# Altium project ESP_MusicToy.PrjPcb (part 2 of 2)

## Sheet [04] Power & Battery.SchDoc
size A3; Author: Caner ALP; Organization: ALP Electronics; Address1: Axel Oxenstiernas; Address2: Västerås; Address3: 72478; Address4: Sweden; DocumentNumber: 5; SheetNumber: 5; SheetTotal: 7
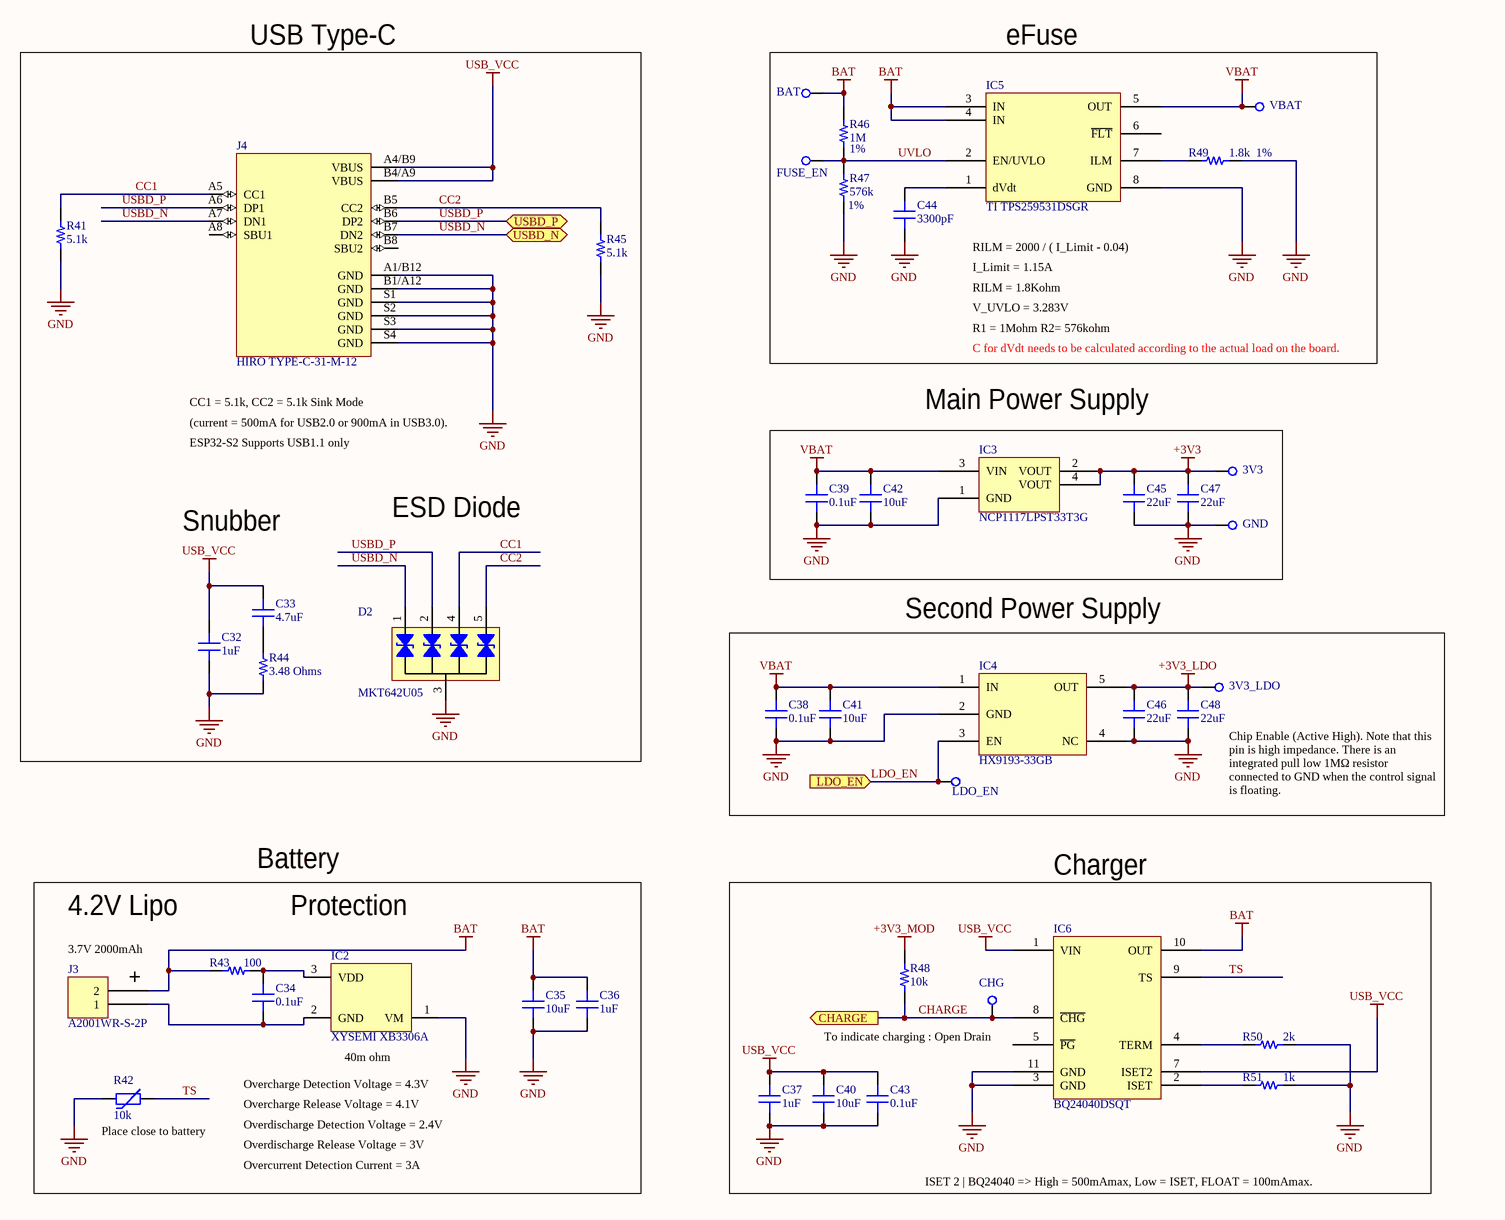
[diagram p4: [04] Power & Battery.SchDoc]

### Parts
3V3  RCT-0C  [TE TP 0805]  (value not drawn)
3V3_LDO  RCT-0C  [TE TP 0805]  (value not drawn)
BAT  RCT-0C  [0.5mm-TestPad]  (value not drawn)
C32  1uF  [CAP 0603/1608]
C33  4.7uF  [CAP 0603/1608]
C34  0.1uF  [CAP 0603/1608]
C35  10uF  [CAP 0603/1608]
C36  1uF  [CAP 0603/1608]
C37  1uF  [CAP 0603/1608]
C38  0.1uF  [CAP 0402/1005]
C39  0.1uF  [CAP 0402/1005]
C40  10uF  [CAP 0603/1608]
C41  10uF  [CAP 0603/1608]
C42  10uF  [CAP 0603/1608]
C43  0.1uF  [CAP 0402/1005]
C44  3300pF  [CAP 0402/1005]
C45  22uF  [CAP 0603/1608]
C46  22uF  [CAP 0603/1608]
C47  22uF  [CAP 0603/1608]
C48  22uF  [CAP 0603/1608]
CHG  RCT-0C  [0.5mm-TestPad]  (value not drawn)
D2  MKT642U05  [TI USON-10 DQA]
FUSE_EN  RCT-0C  [0.5mm-TestPad]  (value not drawn)
GND  RCT-0C  [TE TP 0805]  (value not drawn)
IC2  XYSEMI XB3306A  [DIODES SOT-23-3]
IC3  NCP1117LPST33T3G  [ON SEMI SOT-223 ST(318H)]
IC4  HX9193-33GB  [DBV005]
IC5  TI TPS259531DSGR  [TI WSON-8 DSG 2x2MM]
IC6  BQ24040DSQT  [TI PWSON-10 DSQ]
J3  A2001WR-S-2P  [JST S2B-PH-SM4-TB]
J4  HIRO TYPE-C-31-M-12  [HIRO TYPE-C-31-M-12]
LDO_EN  RCT-0C  [0.5mm-TestPad]  (value not drawn)
R41  5.1k  [RES 0402/1005]
R42  Resistance in Ohms @ 25C: 10k  [FER 0603/1608]
R43  100  [RES 0603/1608]
R44  3.48 Ohms  [RES 0805_2012]
R45  5.1k  [RES 0402/1005]
R46  1M  Tolerance: 1%  [RES 0402/1005]
R47  576k  Tolerance: 1%  [RES 0402/1005]
R48  10k  [RES 0402/1005]
R49  1.8k  Tolerance: 1%  [RES 0402/1005]
R50  2k  [RES 0402/1005]
R51  1k  [RES 0402/1005]
VBAT  RCT-0C  [0.5mm-TestPad]  (value not drawn)

### Blocks framed on the sheet
eFuse: BAT C44 FUSE_EN IC5 R46 R47 R49 VBAT
Main Power Supply: 3V3 C39 C42 C45 C47 GND IC3
Second Power Supply: 3V3_LDO C38 C41 C46 C48 IC4 LDO_EN
Charger: C37 C40 C43 CHG IC6 R48 R50 R51

### Ports
CHARGE (out), LDO_EN (in), USBD_N (bidir), USBD_P (bidir)

### Nets
+3V3: 3V3.1(TP) C45.2 C47.2 IC3.2(VOUT) IC3.4(VOUT)
+3V3_LDO: 3V3_LDO.1(TP) C46.2 C48.2 IC4.5(OUT)
+3V3_MOD: R48.2
BAT: BAT.1(TP) C35.2 C36.1 IC5.3(IN) IC5.4(IN) IC6.10(OUT) J3.2 R43.1 R46.2
GND: C32.2 C35.1 C36.2 C37.2 C38.1 C39.1 C40.1 C41.1 C42.1 C43.1 C44.1 C45.1 C46.1 C47.1 C48.1 D2.3(GND) GND.1(TP) IC2.1(VM) IC3.1(GND) IC4.2(GND) IC4.4(NC) IC5.8(GND) IC6.3(GND) IC6.11(GND) J4.A1/B12(GND) J4.B1/A12(GND) J4.S1(GND) J4.S2(GND) J4.S3(GND) J4.S4(GND) R41.1 R42.1 R44.1 R45.1 R47.1 R49.2 R50.1 R51.2
USB_VCC: C32.1 C33.2 C37.1 C40.2 C43.2 IC6.1(VIN) IC6.7(ISET2) J4.A4/B9(VBUS) J4.B4/A9(VBUS)
VBAT: C38.2 C39.2 C41.2 C42.2 IC3.3(VIN) IC4.1(IN) IC5.5(OUT) VBAT.1(TP)
CC1: D2.4(D3) J4.A5(CC1) R41.2
CC2: D2.5(D4) J4.B5(CC2) R45.2
CHARGE: CHG.1(TP) IC6.8(~{CHG}) R48.1 ; port CHARGE
LDO_EN: IC4.3(EN) LDO_EN.1(TP) ; port LDO_EN
TS: IC6.9(TS) R42.2
USBD_N: D2.1(D1) J4.A7(DN1) J4.B7(DN2) ; port USBD_N
USBD_P: D2.2(D2) J4.A6(DP1) J4.B6(DP2) ; port USBD_P
UVLO: FUSE_EN.1(TP) IC5.2(EN/UVLO) R46.1 R47.2
NetC33_1: C33.1 R44.2
NetC34_1: C34.1 IC2.3(VDD) R43.2
NetC34_2: C34.2 IC2.2(GND) J3.1
NetC44_2: C44.2 IC5.1(dVdt)
NetIC5_7: IC5.7(ILM) R49.1
NetIC6_2: IC6.2(ISET) R51.1
NetIC6_4: IC6.4(TERM) R50.2

Not connected (* = marked no-connect by the designer): IC5 6(~{FLT}); IC6 5(~{PG}); J4 A8(SBU1) B8(SBU2)

### Notes on the sheet
- USB Type-C
- RILM = 2000 / ( I_Limit - 0.04)
- V_UVLO = 3.283V
- I_Limit = 1.15A
- RILM = 1.8Kohm
- R1 = 1Mohm R2= 576kohm
- C for dVdt needs to be calculated according to the actual load on the board.
- (current = 500mA for USB2.0 or 900mA in USB3.0).
- CC1 = 5.1k, CC2 = 5.1k Sink Mode
- ESP32-S2 Supports USB1.1 only
- ESD Diode
- Snubber
- Chip Enable (Active High). Note that this pin is high impedance. There is an integrated pull low 1MΩ resistor connected to GND when the control signal is floating.
- 4.2V Lipo
- Battery
- Protection
- (near J3) 3.7V 2000mAh
- (near J3) +
- (near IC2) 40m ohm
- To indicate charging : Open Drain
- (near R42) Place close to battery
- Overcharge Detection Voltage = 4.3V
- Overdischarge Detection Voltage = 2.4V
- Overcharge Release Voltage = 4.1V
- Overdischarge Release Voltage = 3V
- Overcurrent Detection Current = 3A
- ISET 2 | BQ24040 => High = 500mAmax, Low = ISET, FLOAT = 100mAmax.
- Title
- Size:
- Project
- A3
- Revision:
- Date:
- Sheet
- of

### Library data of the parts
3V3 3V3_LDO BAT CHG FUSE_EN GND LDO_EN VBAT = RCT-0C: 0805 PROBE PAD; Manufacturer: TE Connectivity AMP Connectors; Part Number: RCT-0C; PartId: 15704; Supplier 1: Digi-Key; Supplier Part Number 1: A106144CT-ND; ComponentLink1Description: Datasheet; ComponentLink1URL: http://www.te.com/commerce/DocumentDelivery/DDEController?Action=srchrtrv&DocNm=1773266&DocType=DS&DocLang=English; ComponentLink2Description: Digi-Key Listing; ComponentLink2URL: http://www.digikey.com/product-detail/en/te-connectivity-amp-connectors/RCT-0C/A106144CT-ND/3477801; Price: 0,14; Type: PC Test Point; Mounting Type: Surface Mount
C32 C36 C37 = CGB3B1X7R1A105K055AC: CAP CER 1UF 10V X7R 0603; Manufacturer: TDK Corporation; TemperatureRange: -55C ~ 125C; Tolerance: 10%; Type: Low Profile; Value: 1uF; Part Number: CGB3B1X7R1A105K055AC; PartId: 4131; Supplier 1: Digi-Key; Supplier Part Number 1: 445-13228-1-ND; ComponentLink1Description: Datasheet; ComponentLink1URL: https://product.tdk.com/info/en/catalog/datasheets/mlcc_commercial_lowprofile_en.pdf; ComponentLink2Description: Digi-Key listing; ComponentLink2URL: http://digikey.com/product-detail/en/CGB3B1X7R1A105K055AC/445-13228-1-ND/3954894; TemperatureCoefficient: X7R; Voltage: 10V; Price: 0,27; Device Package: 0603 (1608 Metric)
C33 = C1608X5R1A475K080AC: CAP CER 4.7UF 10V X5R 0603; Manufacturer: TDK Corporation; TemperatureRange: -55C ~ 85C; Tolerance: 10%; Value: 4.7uF; Part Number: C1608X5R1A475K080AC; PartId: 13010; Supplier 1: Digi-Key; Supplier Part Number 1: 445-5170-2-ND; ComponentLink1Description: Datasheet; ComponentLink1URL: https://product.tdk.com/info/en/catalog/datasheets/mlcc_commercial_general_en.pdf; ComponentLink2Description: Digi-Key Listing; ComponentLink2URL: https://www.digikey.com/product-detail/en/tdk-corporation/C1608X5R1A475K080AC/445-5170-2-ND/2093438; TemperatureCoefficient: X5R; Voltage: 10V; Price: 0,0333; Device Package: 0603 (1608 Metric)
C34 = CC0603KPX7R7BB104: CAP CER 0.1UF 16V X7R 0603; Manufacturer: Yageo; TemperatureRange: -55C ~ 125C; Tolerance: 10%; Value: 0.1uF; Part Number: CC0603KPX7R7BB104; PartId: 5262; Supplier 1: Digi-Key; Supplier Part Number 1: 311-1335-2-ND; ComponentLink1Description: Datasheet; ComponentLink1URL: http://www.yageo.com/documents/recent/UPY-GPHC_X7R_6.3V-to-50V-v12.pdf; ComponentLink2Description: Digi-Key listing; ComponentLink2URL: http://digikey.com/product-detail/en/CC0603KPX7R7BB104/311-1335-2-ND/2103073; TemperatureCoefficient: X7R; Voltage: 16V; Price: 0,0043; Type: -; Device Package: 0603 (1608 Metric)
C35 C40-C42 = C1608X5R1A106M080AC: CAP CER 10UF 10V X5R 0603; Manufacturer: TDK Corporation; TemperatureRange: -55C ~ 85C; Tolerance: 20%; Value: 10uF; Part Number: C1608X5R1A106M080AC; PartId: 13099; Supplier 1: Digi-Key; Supplier Part Number 1: 445-6853-2-ND; ComponentLink1Description: Datasheet; ComponentLink1URL: https://product.tdk.com/info/en/catalog/datasheets/mlcc_commercial_general_en.pdf; ComponentLink2Description: Digi-Key Listing; ComponentLink2URL: https://www.digikey.com/product-detail/en/tdk-corporation/C1608X5R1A106M080AC/445-6853-2-ND/2619194; TemperatureCoefficient: X5R; Voltage: 10V; Price: 0,0935; Device Package: 0603 (1608 Metric)
C38 C39 C43 = C1005X7R1A104K050BB: CAP CER 0.1UF 10V X7R 0402; Manufacturer: TDK Corporation; TemperatureRange: -55C ~ 125C; Tolerance: 10%; Value: 0.1uF; Part Number: C1005X7R1A104K050BB; PartId: 3900; Supplier 1: Digi-Key; Supplier Part Number 1: 445-4958-2-ND; ComponentLink1Description: Datasheet; ComponentLink1URL: https://product.tdk.com/info/en/catalog/datasheets/mlcc_commercial_general_en.pdf; ComponentLink2Description: Digi-Key listing; ComponentLink2URL: http://digikey.com/product-detail/en/C1005X7R1A104K050BB/445-4958-2-ND/2093226; TemperatureCoefficient: X7R; Voltage: 10V; Price: 0,0066; Type: -; Device Package: 0402 (1005 Metric)
C44 = CGJ2B2X7R1E332K050BA: CAP CER 3300PF 25V X7R 0402; Manufacturer: TDK Corporation; TemperatureRange: -55C ~ 125C; Tolerance: 10%; Value: 3300pF; Part Number: CGJ2B2X7R1E332K050BA; PartId: 12699; Supplier 1: Digi-Key; Supplier Part Number 1: 445-8075-2-ND; ComponentLink1Description: Datasheet; ComponentLink1URL: https://product.tdk.com/info/en/catalog/datasheets/mlcc_highreliability_general_en.pdf; ComponentLink2Description: Digi-Key Listing; ComponentLink2URL: https://www.digikey.com/product-detail/en/tdk-corporation/CGJ2B2X7R1E332K050BA/445-8075-2-ND/2812488; TemperatureCoefficient: X7R; Voltage: 25V; Price: 0,0192; Device Package: 0402 (1005 Metric)
C45-C48 = C1608X5R1A226M080AC: CAP CER 22UF 10V X5R 0603; Manufacturer: TDK Corporation; TemperatureRange: -55C ~ 85C; Tolerance: 20%; Value: 22uF; Part Number: C1608X5R1A226M080AC; PartId: 12987; Supplier 1: Digi-Key; Supplier Part Number 1: 445-9077-2-ND; ComponentLink1Description: Datasheet; ComponentLink1URL: https://product.tdk.com/info/en/catalog/datasheets/mlcc_commercial_general_en.pdf; ComponentLink2Description: Digi-Key Listing; ComponentLink2URL: https://www.digikey.com/product-detail/en/tdk-corporation/C1608X5R1A226M080AC/445-9077-2-ND/3661560; TemperatureCoefficient: X5R; Voltage: 10V; Price: 0,105; Device Package: 0603 (1608 Metric)
D2 = TPD4E05U06DQAR: TVS DIODE  4-Channel 5.5VWM 14VC 10SON; Manufacturer: Texas Instruments; Type: Zener; Bidirectional Channels: 4; Part Number: TPD4E05U06DQAR; PartId: 14960; Supplier 1: Digi-Key; Device Package: USON-10
IC2 = XYSEMI XB3306A: IC LITHIUM BATT PROTECT SOT23-3; Function: Protection; Battery Chemistry: Li-Ion, Li-Pol; Part Number: XYSEMI XB3306A; PartId: 16446; Manufacturer: XYSEMI; Supplier 1: LCSC; Supplier Part Number 1: C154939; ComponentLink1Description: Datasheet; ComponentLink1URL: http://www.baitaishengshi.com/uploadfile/2017/1213/20171213368970.pdf; ComponentLink2Description: LCSC Listing; ComponentLink2URL: https://lcsc.com/product-detail/Battery-Protection-ICs_XB3306A_C154939.html; Device Package: SOT-23-3
IC3 = NCP1117LPST33T3G: IC REG LDO 3.3V 1A SOT223; Manufacturer: ON Semiconductor; Topology: Positive Fixed; Voltage Dropout: 1.3V @ 1A; Voltage - Input: Up to 18V; Current - Limit (Min): 1.1A; Part Number: NCP1117LPST33T3G; PartId: 7931; Supplier 1: Digi-Key; Supplier Part Number 1: NCP1117LPST33T3GOSTR-ND; ComponentLink1Description: Datasheet; ComponentLink1URL: http://www.onsemi.com/pub_link/Collateral/NCP1117LP-D.PDF; ComponentLink2Description: Digi-Key Listing; ComponentLink2URL: http://www.digikey.ca/product-detail/en/NCP1117LPST33T3G/NCP1117LPST33T3GOSTR-ND/2194024; Price: 0,1843; Device Package: TO-261-4, TO-261AA; Voltage - Output: 3.3V; Operating Temperature: 0C ~ 125C
IC4 = TPS736xx: LDO
IC6 = BQ24040DSQT: IC LI-ION CHRG 800MA 6.6V 10SON; Manufacturer: Texas Instruments; Function: Charge Management; Battery Chemistry: Li-Ion, Li-Pol; Voltage Supply: 3.5 V ~ 28 V; Part Number: BQ24040DSQT; PartId: 9307; Supplier 1: Digi-Key; Supplier Part Number 1: 296-25136-2-ND; ComponentLink1Description: Datasheet; ComponentLink1URL: http://www.ti.com/lit/ds/symlink/bq24040.pdf; ComponentLink2Description: Digi-Key Listing; ComponentLink2URL: http://www.digikey.com/product-detail/en/BQ24040DSQT/296-25136-2-ND/2165906; Price: 0,9352; Device Package: 10-WFDFN Exposed Pad; Series: -; Operating Temperature: -40C ~ 85C
J3 = S2B-PH-SM4-TB(LF)(SN): CONN HEADER SMD R/A 2POS 2MM; Manufacturer: JST Sales America Inc.; Contact Length - Mating: 0.130" (3.30mm); Current Rating (Amps): 2A; Material Flammability Rating: UL94 V-0; Number of Positions: 2; Number of Positions Loaded: All; Pitch - Mating: 0.079" (2.00mm); Shrouding: Shrouded - 4 Wall; Style: Board to Cable/Wire; Voltage Rating: 100V; Part Number: S2B-PH-SM4-TB(LF)(SN); ComponentLink1Description: Datasheet; ComponentLink1URL: http://www.jst-mfg.com/product/pdf/eng/ePH.pdf; ComponentLink2Description: DigiKey Link; ComponentLink2URL: http://digikey.com/product-detail/en/jst-sales-america-inc/S2B-PH-SM4-TB-LF-SN/455-1749-1-ND/926846; Connector Type: Header; Contact Finish - Mating: Tin; Contact Finish - Post: Tin; Contact Material: Copper Alloy; Contact Shape: Square; Contact Type: Male Pin; Fastening Type: Detent Lock; Features: Solder Retention; Insulation Color: Natural; Insulation Height: 0.217" (5.51mm); Insulation Material: Polyamide (PA6T), Nylon 6T; LastUpdated: 2020-01-15 03:45:11; Lifecycle Status: Active; Minimum Order: 1; Mounting Type: Surface Mount, Right Angle; Number of Rows: 1; Operating Temperature: -25°C ~ 85°C; Packaging: TapeAndReel; PartId: 115; Part Status: Active; Price: 0.27; Series: PH; Supplier 1: DigiKey; Supplier Part Number 1: 455-1749-1-ND; Termination: Solder
J4 = HIRO TYPE-C-31-M-12: CONN USB 2.0 TYPE-C R/A SMT; Number Of Positions: 12; Part Number: HIRO TYPE-C-31-M-12; PartId: 9703; Manufacturer: Hiro; Supplier 1: LCSC; Supplier Part Number 1: C165948; ComponentLink1Description: Datasheet; ComponentLink1URL: https://datasheet.lcsc.com/szlcsc/1811131825_Korean-Hroparts-Elec-TYPE-C-31-M-12_C165948.pdf; ComponentLink2Description: LCSC Listing; ComponentLink2URL: https://lcsc.com/product-detail/USB-Type-C_Korean-Hroparts-Elec-TYPE-C-31-M-12_C165948.html; Type: USB - C; Series: USB 3.0
R41 R45 = ERJ-2RKF5101X: RES SMD 5.1K OHM 1% 1/10W 0402; Manufacturer: Panasonic Electronic Components; TemperatureRange: -55C ~ 155C; TemperatureCoefficient: 100ppm/C; PowerRating: 0.1W, 1/10W; Value: 5.1k; Part Number: ERJ-2RKF5101X; PartId: 274; Supplier 1: Digi-Key; Supplier Part Number 1: P5.10KLTR-ND; ComponentLink1Description: Datasheet; ComponentLink1URL: http://industrial.panasonic.com/www-cgi/jvcr13pz.cgi?E+PZ+3+AOA0002+ERJ2RKF5101X+7+WW; ComponentLink2Description: Digikey listing; ComponentLink2URL: http://digikey.com/product-detail/en/ERJ-2RKF5101X/P5.10KLTR-ND/1746242; Tolerance: 1%; Price: 0,0043; Type: Thick Film; Device Package: 0402 (1005 Metric)
R42 = B57330V2103J260: NTC 0603 10K OHM 5%; Manufacturer: EPCOS (TDK); TemperatureRange: -55C ~ 125C; B Value Tolerance: 3%; B25/50: 3380K; B25/85: 3435K; B25/100: 3455K; Power - Max: 180mW; Value: 10k; Part Number: B57330V2103J260; PartId: 16688; Supplier 1: Digi-Key; Supplier Part Number 1: 495-5817-2-ND; ComponentLink1Description: Datasheet; ComponentLink1URL: https://product.tdk.com/search-template/en/documents/data_sheet/50/db/ntc_13/NTC_SMD_Standard_series_0603.pdf; ComponentLink2Description: Digi-Key Listing; ComponentLink2URL: https://www.digikey.com/product-detail/en/epcos-tdk/B57330V2103J260/495-5817-2-ND/4360622; Price: 0,1225; Resistance Tolerance: 5%; Device Package: 0603 (1608 Metric)
R43 = ERJ-3GEYJ101V: RES SMD 100 OHM 5% 1/10W 0603; Manufacturer: Panasonic Electronic Components; TemperatureRange: -55C ~ 155C; TemperatureCoefficient: 200ppm/C; PowerRating: 0.1W, 1/10W; Value: 100; Part Number: ERJ-3GEYJ101V; PartId: 11179; Supplier 1: Digi-Key; Supplier Part Number 1: P100GTR-ND; ComponentLink1Description: Datasheet; ComponentLink1URL: http://industrial.panasonic.com/www-cgi/jvcr13pz.cgi?E+PZ+3+AOA0001+ERJ3GEYJ101V+7+WW; ComponentLink2Description: Digi-Key Listing; ComponentLink2URL: https://www.digikey.com/product-detail/en/panasonic-electronic-components/ERJ-3GEYJ101V/P100GTR-ND/135659; Tolerance: 5%; Price: 0,002; Device Package: 0603 (1608 Metric)
R44 = RC0805FR-073R48L: RES SMD 3.48 OHM 1% 1/8W 0805; Manufacturer: Yageo; Power (Watts): 0.125W, 1/8W; Temperature Coefficient: ±200ppm/°C; Part Number: RC0805FR-073R48L; Value: 3.48 Ohms; ComponentLink1Description: Datasheet; ComponentLink1URL: https://www.yageo.com/upload/media/product/productsearch/datasheet/rchip/PYu-RC_Group_51_RoHS_L_10.pdf; ComponentLink2Description: DigiKey Link; ComponentLink2URL: http://digikey.com/product-detail/en/yageo/RC0805FR-073R48L/311-3.48CRCT-ND/730768; Composition: Thick Film; Device Package: 0805 (2012 Metric); Features: Moisture Resistant; Height - Seated (Max): 0.024" (0.60mm); LastUpdated: 21/01/2020 01:49:21; Lifecycle Status: Active; Minimum Order: 1; Number of Terminations: 2; Operating Temperature: -55°C ~ 155°C; Package / Case: 0805 (2012 Metric); Packaging: TapeAndReel; PartId: 29394; Part Status: Active; Price: 0.01; Resistance: 3.48 Ohms; Series: RC; Size / Dimension: 0.079" L x 0.049" W (2.00mm x 1.25mm); Supplier 1: DigiKey; Supplier Part Number 1: 311-3.48CRCT-ND; Supplier Device Package: 0805; Tolerance: ±1%
R46 = ERJ-2RKF1004X: RES SMD 1M OHM 1% 1/10W 0402; Manufacturer: Panasonic Electronic Components; TemperatureRange: -55C ~ 155C; TemperatureCoefficient: 100ppm/C; PowerRating: 0.1W, 1/10W; Value: 1M; Part Number: ERJ-2RKF1004X; PartId: 7; Supplier 1: Digi-Key; Supplier Part Number 1: P1.00MLTR-ND; ComponentLink1Description: Datasheet; ComponentLink1URL: http://industrial.panasonic.com/www-cgi/jvcr13pz.cgi?E+PZ+3+AOA0002+ERJ2RKF1004X+7+WW; ComponentLink2Description: Digikey listing; ComponentLink2URL: http://digikey.com/product-detail/en/ERJ-2RKF1004X/P1.00MLTR-ND/79728; Price: 0,0043; Type: Thick Film; Device Package: 0402 (1005 Metric)
R47 = ERJ-2RKF5763X: RES SMD 576K OHM 1% 1/10W 0402; Manufacturer: Panasonic Electronic Components; TemperatureRange: -55C ~ 155C; TemperatureCoefficient: 100ppm/C; PowerRating: 0.1W, 1/10W; Value: 576k; Part Number: ERJ-2RKF5763X; PartId: 437; Supplier 1: Digi-Key; Supplier Part Number 1: P576KLTR-ND; ComponentLink1Description: Datasheet; ComponentLink1URL: http://industrial.panasonic.com/www-cgi/jvcr13pz.cgi?E+PZ+3+AOA0002+ERJ2RKF5763X+7+WW; ComponentLink2Description: Digikey listing; ComponentLink2URL: http://digikey.com/product-detail/en/ERJ-2RKF5763X/P576KLTR-ND/192415; Price: 0,0043; Type: Thick Film; Device Package: 0402 (1005 Metric)
R48 = RC0402JR-0710KL: RES SMD 10K OHM 5% 1/16W 0402; Manufacturer: Yageo; TemperatureRange: -55C ~ 155C; TemperatureCoefficient: 100ppm/C; PowerRating: 0.063W, 1/16W; Value: 10k; Part Number: RC0402JR-0710KL; PartId: 14464; Supplier 1: Digi-Key; Supplier Part Number 1: 311-10KJRTR-ND; ComponentLink1Description: Datasheet; ComponentLink1URL: http://www.yageo.com/documents/recent/PYu-RC_Group_51_RoHS_L_04.pdf; ComponentLink2Description: Digi-Key Listing; ComponentLink2URL: https://www.digikey.com/product-detail/en/yageo/RC0402JR-0710KL/311-10KJRTR-ND/726418; Tolerance: 5%; Price: 0,0017; Device Package: 0402 (1005 Metric)
R49 = ERJ-2RKF1801X: RES SMD 1.8K OHM 1% 1/10W 0402; Manufacturer: Panasonic Electronic Components; TemperatureRange: -55C ~ 155C; TemperatureCoefficient: 100ppm/C; PowerRating: 0.1W, 1/10W; Value: 1.8k; Part Number: ERJ-2RKF1801X; PartId: 153; Supplier 1: Digi-Key; Supplier Part Number 1: P1.80KLTR-ND; ComponentLink1Description: Datasheet; ComponentLink1URL: http://industrial.panasonic.com/www-cgi/jvcr13pz.cgi?E+PZ+3+AOA0002+ERJ2RKF1801X+7+WW; ComponentLink2Description: Digikey listing; ComponentLink2URL: http://digikey.com/product-detail/en/ERJ-2RKF1801X/P1.80KLTR-ND/1746140; Price: 0,0043; Type: Thick Film; Device Package: 0402 (1005 Metric)
R50 = ERJ-2GEJ202X: RES SMD 2K OHM 5% 1/10W 0402; Manufacturer: Panasonic Electronic Components; TemperatureRange: -55C ~ 155C; TemperatureCoefficient: 200ppm/C; PowerRating: 0.1W, 1/10W; Value: 2k; Part Number: ERJ-2GEJ202X; PartId: 11049; Supplier 1: Digi-Key; Supplier Part Number 1: P2.0KJTR-ND; ComponentLink1Description: Datasheet; ComponentLink1URL: http://industrial.panasonic.com/www-cgi/jvcr13pz.cgi?E+PZ+3+AOA0001+ERJ2GEJ202X+7+WW; ComponentLink2Description: Digi-Key Listing; ComponentLink2URL: https://www.digikey.com/product-detail/en/panasonic-electronic-components/ERJ-2GEJ202X/P2.0KJTR-ND/146958; Tolerance: 5%; Price: 0,0019; Device Package: 0402 (1005 Metric)
R51 = ERJ-2RKF1001X: RES SMD 1K OHM 1% 1/10W 0402; Manufacturer: Panasonic Electronic Components; TemperatureRange: -55C ~ 155C; TemperatureCoefficient: 100ppm/C; PowerRating: 0.1W, 1/10W; Value: 1k; Part Number: ERJ-2RKF1001X; PartId: 4; Supplier 1: Digi-Key; Supplier Part Number 1: P1.00KLTR-ND; ComponentLink1Description: Datasheet; ComponentLink1URL: http://industrial.panasonic.com/www-cgi/jvcr13pz.cgi?E+PZ+3+AOA0002+ERJ2RKF1001X+7+WW; ComponentLink2Description: Digikey listing; ComponentLink2URL: http://digikey.com/product-detail/en/ERJ-2RKF1001X/P1.00KLTR-ND/79729; Tolerance: 1%; Price: 0,0043; Type: Thick Film; Device Package: 0402 (1005 Metric)

## Sheet [05] NFC.SchDoc: NFC
size A3; Author: Caner ALP; Organization: ALP Electronics; Address1: Axel Oxenstiernas; Address2: Västerås; Address3: 72478; Address4: Sweden; DocumentNumber: 6; SheetNumber: 6; SheetTotal: 7
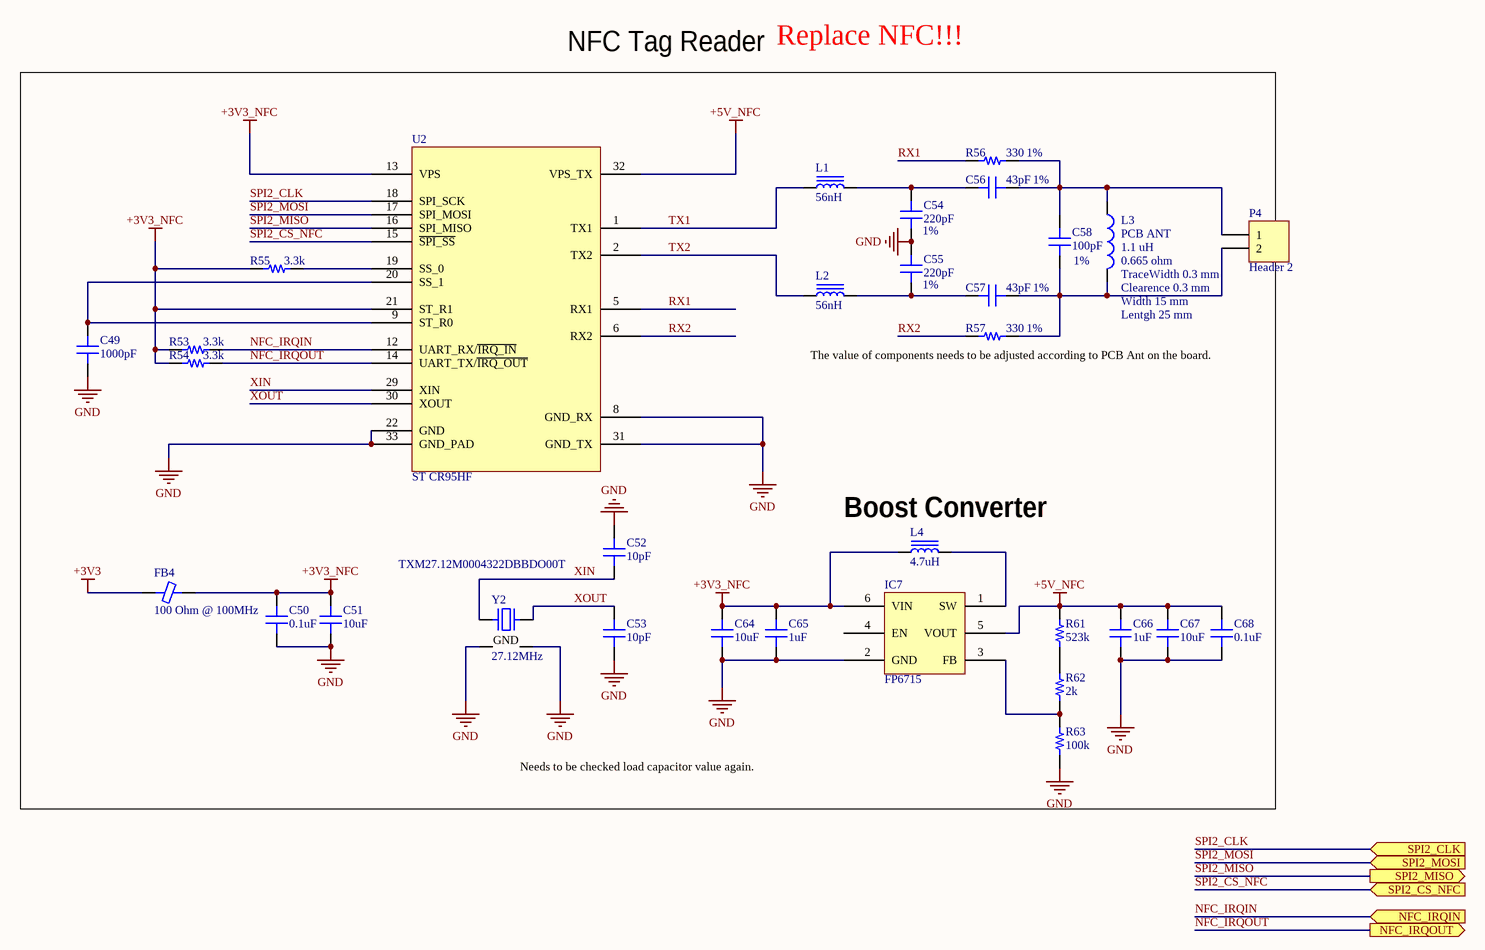
[diagram p5: [05] NFC.SchDoc]

### Parts
C49  1000pF  [CAP 0402/1005]
C50  0.1uF  [CAP 0402/1005]
C51  10uF  [CAP 0603/1608]
C52  10pF  [CAP 0402/1005]
C53  10pF  [CAP 0402/1005]
C54  220pF  Tolerance: 1%  [CAP 0402/1005]
C55  220pF  Tolerance: 1%  [CAP 0402/1005]
C56  43pF  Tolerance: 1%  [CAP 0402/1005]
C57  43pF  Tolerance: 1%  [CAP 0402/1005]
C58  100pF  Tolerance: 1%  [CAP 0402/1005]
C64  10uF  [CAP 0603/1608]
C65  1uF  [CAP 0603/1608]
C66  1uF  [CAP 0603/1608]
C67  10uF  [CAP 0603/1608]
C68  0.1uF  [CAP 0402/1005]
FB4  100 Ohm @ 100MHz  [FER 0603/1608]
IC7  FP6715  [ATMEL SOT-23-6 6ST1]
L1  56nH  [IND 0402/1005 RF WW]
L2  56nH  [IND 0402/1005 RF WW]
L3  PCB ANT  L_ANT: 1.1 uH  R_ANT: 0.665 ohm  TraceWidth: TraceWidth 0.3 mm  Clearence: Clearence 0.3 mm  Width: Width 15 mm  Length: Lentgh 25 mm  [0402-A]
L4  4.7uH  [TDK SPM3012]
P4  Header 2  [HDR1X2]
R53  3.3k  [RES 0402/1005]
R54  3.3k  [RES 0402/1005]
R55  3.3k  [RES 0402/1005]
R56  330  Tolerance: 1%  [RES 0402/1005]
R57  330  Tolerance: 1%  [RES 0402/1005]
R61  523k  [RES 0402/1005]
R62  2k  [RES 0402/1005]
R63  100k  [RES 0402/1005]
U2  ST CR95HF  [ST VFQFPN-32]
Y2  27.12MHz  Part Number: TXM27.12M0004322DBBDO00T  [NDK NX3225SA]

### Ports
NFC_IRQIN (in), NFC_IRQOUT (out), SPI2_CLK (in), SPI2_CS_NFC (in), SPI2_MISO (out), SPI2_MOSI (in)

### Nets
+3V3: FB4.1
+3V3_NFC: C50.2 C51.2 C64.2 C65.2 FB4.2 IC7.6(VIN) L4.1 R53.1 R54.1 R55.1 U2.13(VPS) U2.21(ST_R1)
+5V_NFC: C66.2 C67.2 C68.2 IC7.5(VOUT) R61.2 U2.32(VPS_TX)
GND: C49.1 C50.1 C51.1 C52.2 C53.1 C54.1 C55.2 C64.1 C65.1 C66.1 C67.1 C68.1 IC7.2(GND) R63.1 U2.8(GND_RX) U2.22(GND) U2.31(GND_TX) U2.33(GND_PAD) Y2.2(GND) Y2.4(GND)
NFC_IRQIN: R53.2 U2.12(UART_RX/~{IRQ_IN}) ; port NFC_IRQIN
NFC_IRQOUT: R54.2 U2.14(UART_TX/~{IRQ_OUT}) ; port NFC_IRQOUT
RX1: R56.1 U2.5(RX1)
RX2: R57.1 U2.6(RX2)
SPI2_CLK: U2.18(SPI_SCK) ; port SPI2_CLK
SPI2_CS_NFC: U2.15(~{SPI_SS}) ; port SPI2_CS_NFC
SPI2_MISO: U2.16(SPI_MISO) ; port SPI2_MISO
SPI2_MOSI: U2.17(SPI_MOSI) ; port SPI2_MOSI
TX1: L1.1 U2.1(TX1)
TX2: L2.1 U2.2(TX2)
XIN: C52.1 U2.29(XIN) Y2.1
XOUT: C53.2 U2.30(XOUT) Y2.3
NetC49_2: C49.2 U2.9(ST_R0) U2.20(SS_1)
NetC54_2: C54.2 C56.1 L1.2
NetC55_1: C55.1 C57.1 L2.2
NetC56_2: C56.2 C58.2 L3.1 P4.1 R56.2
NetC57_2: C57.2 C58.1 L3.2 P4.2 R57.2
NetIC7_1: IC7.1(SW) L4.2
NetIC7_3: IC7.3(FB) R62.1 R63.2
NetR55_2: R55.2 U2.19(SS_0)
NetR61_1: R61.1 R62.2

Not connected (* = marked no-connect by the designer): IC7 4(EN); U2 3(NC) 4(NC) 7(NC) 10(NC) 11(NC) 23(NC) 24(NC) 25(NC) 26(NC) 27(NC) 28(NC)

### Notes on the sheet
- NFC Tag Reader
- Replace NFC!!!
- (near R57) The value of components needs to be adjusted according to PCB Ant on the board.
- (near L4) Boost Converter
- Needs to be checked load capacitor value again.
- Title
- Size:
- Project
- A3
- Revision:
- Date:
- Sheet
- of

### Library data of the parts
C49 = C0402C102K9RACTU: CAP CER 1000PF 6.3V X7R 0402; Manufacturer: Kemet; TemperatureRange: -55C ~ 125C; Tolerance: 10%; Value: 1000pF; Part Number: C0402C102K9RACTU; PartId: 12782; Supplier 1: Digi-Key; Supplier Part Number 1: 399-8941-2-ND; ComponentLink1Description: Datasheet; ComponentLink1URL: http://www.kemet.com/docfinder?Partnumber=C0402C102K9RACTU; ComponentLink2Description: Digi-Key Listing; ComponentLink2URL: https://www.digikey.com/product-detail/en/kemet/C0402C102K9RACTU/399-8941-2-ND/2196206; TemperatureCoefficient: X7R; Voltage: 6.3V; Price: 0,0029; Device Package: 0402 (1005 Metric)
C50 C68 = C1005X7R1A104K050BB: as C38 on sheet [04] Power & Battery; Value: 0.1uF; Part Number: C1005X7R1A104K050BB; PartId: 3900; Supplier 1: Digi-Key; Supplier Part Number 1: 445-4958-2-ND; ComponentLink1Description: Datasheet; ComponentLink1URL: https://product.tdk.com/info/en/catalog/datasheets/mlcc_commercial_general_en.pdf; ComponentLink2Description: Digi-Key listing; ComponentLink2URL: http://digikey.com/product-detail/en/C1005X7R1A104K050BB/445-4958-2-ND/2093226; TemperatureCoefficient: X7R; Voltage: 10V; Price: 0,0066; Type: -; Device Package: 0402 (1005 Metric)
C51 C67 = C1608X5R1A106M080AC: as C35 on sheet [04] Power & Battery; Value: 10uF; Part Number: C1608X5R1A106M080AC; PartId: 13099; Supplier 1: Digi-Key; Supplier Part Number 1: 445-6853-2-ND; ComponentLink1Description: Datasheet; ComponentLink1URL: https://product.tdk.com/info/en/catalog/datasheets/mlcc_commercial_general_en.pdf; ComponentLink2Description: Digi-Key Listing; ComponentLink2URL: https://www.digikey.com/product-detail/en/tdk-corporation/C1608X5R1A106M080AC/445-6853-2-ND/2619194; TemperatureCoefficient: X5R; Voltage: 10V; Price: 0,0935; Device Package: 0603 (1608 Metric)
C52 C53 = C0402C100C8GACTU: CAP CER 10PF 10V NP0 0402; Manufacturer: Kemet; TemperatureRange: -55C ~ 125C; TemperatureCoefficient: C0G, NP0; Tolerance: 0.25pF; Value: 10pF; Part Number: C0402C100C8GACTU; PartId: 12811; Supplier 1: Digi-Key; Supplier Part Number 1: 399-8939-2-ND; ComponentLink1Description: Datasheet; ComponentLink1URL: http://www.kemet.com/docfinder?Partnumber=C0402C100C8GACTU; ComponentLink2Description: Digi-Key Listing; ComponentLink2URL: https://www.digikey.com/product-detail/en/kemet/C0402C100C8GACTU/399-8939-2-ND/2196146; Voltage: 10V; Price: 0,0523; Device Package: 0402 (1005 Metric)
C54 C55 = C1005C0G1H221F050BA: CAP CER 220PF 50V C0G 0402; Manufacturer: TDK Corporation; TemperatureRange: -55C ~ 125C; TemperatureCoefficient: C0G, NP0; Value: 220pF; Part Number: C1005C0G1H221F050BA; PartId: 3869; Supplier 1: Digi-Key; Supplier Part Number 1: 445-7015-2-ND; ComponentLink1Description: Datasheet; ComponentLink1URL: https://product.tdk.com/info/en/catalog/datasheets/mlcc_commercial_general_en.pdf; ComponentLink2Description: Digi-Key listing; ComponentLink2URL: http://digikey.com/product-detail/en/C1005C0G1H221F050BA/445-7015-2-ND/2674817; Voltage: 50V; Price: 0,1606; Type: -; Device Package: 0402 (1005 Metric)
C56 C57 = GRM1555C1H430GA01D: CAP CER 43PF 50V NP0 0402; Manufacturer: Murata Electronics North America; TemperatureRange: -55C ~ 125C; TemperatureCoefficient: C0G, NP0; Value: 43pF; Part Number: GRM1555C1H430GA01D; PartId: 5184; Supplier 1: Digi-Key; Supplier Part Number 1: 490-9664-2-ND; ComponentLink1Description: Datasheet; ComponentLink1URL: http://www.murata.com/~/media/webrenewal/support/library/catalog/products/capacitor/mlcc/c02e.ashx; ComponentLink2Description: Digi-Key listing; ComponentLink2URL: http://digikey.com/product-detail/en/GRM1555C1H430GA01D/490-9664-2-ND/3693990; Voltage: 50V; Price: 0,0202; Type: -; Device Package: 0402 (1005 Metric)
C58 = C1005C0G1H101F050BA: CAP CER 100PF 50V C0G 0402; Manufacturer: TDK Corporation; TemperatureRange: -55C ~ 125C; TemperatureCoefficient: C0G, NP0; Value: 100pF; Part Number: C1005C0G1H101F050BA; PartId: 3866; Supplier 1: Digi-Key; Supplier Part Number 1: 445-5362-2-ND; ComponentLink1Description: Datasheet; ComponentLink1URL: https://product.tdk.com/info/en/catalog/datasheets/mlcc_commercial_general_en.pdf; ComponentLink2Description: Digi-Key listing; ComponentLink2URL: http://digikey.com/product-detail/en/C1005C0G1H101F050BA/445-5362-2-ND/2269856; Voltage: 50V; Price: 0,1262; Type: -; Device Package: 0402 (1005 Metric)
C64 = C1608X5R1A106K080AC: CAP CER 10UF 10V X5R 0603; Manufacturer: TDK Corporation; TemperatureRange: -55C ~ 85C; Tolerance: 10%; Value: 10uF; Part Number: C1608X5R1A106K080AC; PartId: 13435; Supplier 1: Digi-Key; Supplier Part Number 1: 445-7486-2-ND; ComponentLink1Description: Datasheet; ComponentLink1URL: https://product.tdk.com/info/en/catalog/datasheets/mlcc_commercial_general_en.pdf; ComponentLink2Description: Digi-Key Listing; ComponentLink2URL: https://www.digikey.com/product-detail/en/tdk-corporation/C1608X5R1A106K080AC/445-7486-2-ND/2732921; TemperatureCoefficient: X5R; Voltage: 10V; Price: 0,102; Device Package: 0603 (1608 Metric)
C65 C66 = C0603C105K3RACTU: CAP CER 1UF 25V X7R 0603; Manufacturer: Kemet; TemperatureRange: -55C ~ 125C; Tolerance: 10%; Value: 1uF; Part Number: C0603C105K3RACTU; PartId: 13359; Supplier 1: Digi-Key; Supplier Part Number 1: 399-7376-2-ND; ComponentLink1Description: Datasheet; ComponentLink1URL: http://www.kemet.com/docfinder?Partnumber=C0603C105K3RACTU; ComponentLink2Description: Digi-Key Listing; ComponentLink2URL: https://www.digikey.com/product-detail/en/kemet/C0603C105K3RACTU/399-7376-2-ND/3317582; TemperatureCoefficient: X7R; Voltage: 25V; Price: 0,044; Device Package: 0603 (1608 Metric)
FB4 = BKP1608HS101-T: FERRITE CHIP 100 OHM 0603; Manufacturer: Taiyo Yuden; Type: Differential Mode - Single; DC Resistance: 50 mOhm Max; Current Rating: 1.7A; Part Number: BKP1608HS101-T; PartId: 6594; Value: 100 Ohm @ 100MHz; Supplier 1: Digi-Key; Supplier Part Number 1: 587-1922-2-ND; ComponentLink1Description: Datasheet; ComponentLink1URL: http://ds.yuden.co.jp/TYCOMPAS/ut/detail.do?productNo=BKP1608HS101-T&fileName=BKP1608HS101-T_SS&mode=specSheetDownload; ComponentLink2Description: Digi-Key listing; ComponentLink2URL: http://digikey.com/product-detail/en/BKP1608HS101-T/587-1922-2-ND/957775; Price: 0,0247; Device Package: 0603 (1608 Metric)
IC7 = FP6715: 550KHz High Efficiency Low Ripple Synchronous Step-Up Converter
L1 L2 = LQW15AN56NG00D: FIXED IND 56NH 200MA 1.17 OHM; Manufacturer: Murata Electronics North America; TemperatureRange: -55C ~ 125C; Tolerance: 2%; Type: Wirewound; Q at Frequency: 25 @ 200MHz; DC Resistance: 1.17 Ohm Max; Shielding: Unshielded; Value: 56nH; Part Number: LQW15AN56NG00D; PartId: 6404; Supplier 1: Digi-Key; Supplier Part Number 1: 490-6830-2-ND; ComponentLink1Description: Datasheet; ComponentLink1URL: http://search.murata.co.jp/Ceramy/image/img/PDF/ENG/L0075S0080LQW15A_00.pdf; ComponentLink2Description: Digi-Key listing; ComponentLink2URL: http://digikey.com/product-detail/en/LQW15AN56NG00D/490-6830-2-ND/2594932; Price: 0,0807; Device Package: 0402 (1005 Metric)
L3 = Inductor: Code_IEC: 1005; Value: 10mH; Published: 8-Jun-2000; LatestRevisionDate: 29-May-2009; LatestRevisionNote: IPC-7351 Footprint Added.; PackageReference: 0402-A; Publisher: Altium Limited; PackageDescription: Chip Inductor; Code_JEITA: 0402
L4 = SPM3012T-4R7M: FIXED IND 4.7UH 1.3A 270 MOHM; Manufacturer: TDK Corporation; Type: Wirewound; Tolerance: 20%; Shielding: Shielded; DC Resistance (DCR): 270 mOhm Max; Value: 4.7uH; Part Number: SPM3012T-4R7M; PartId: 9592; Supplier 1: Digi-Key; Supplier Part Number 1: 445-8932-2-ND; ComponentLink1Description: Datasheet; ComponentLink1URL: https://product.tdk.com/info/en/catalog/datasheets/inductor_commercial_power_spm3012_en.pdf; ComponentLink2Description: Digi-Key Listing; ComponentLink2URL: https://www.digikey.com/product-detail/en/SPM3012T-4R7M/445-8932-2-ND/3641271; Price: 0.616; Device Package: Nonstandard; Series: SPM; Inductance: 4.7uH; Current Rating: 1.3A; Q @ Freq: -; Frequency - Self Resonant: -; Operating Temperature: -40C ~ 125C
P4 = Header 2: Header, 2-Pin; LatestRevisionDate: 17-Jul-2002; LatestRevisionNote: Re-released for DXP Platform.; Publisher: Altium Limited
R53-R55 = RC0402JR-073K3L: RES SMD 3.3K OHM 5% 1/16W 0402; Manufacturer: Yageo; TemperatureRange: -55C ~ 155C; TemperatureCoefficient: 100ppm/C; PowerRating: 0.063W, 1/16W; Value: 3.3k; Part Number: RC0402JR-073K3L; PartId: 14533; Supplier 1: Digi-Key; Supplier Part Number 1: 311-3.3KJRTR-ND; ComponentLink1Description: Datasheet; ComponentLink1URL: http://www.yageo.com/documents/recent/PYu-RC_Group_51_RoHS_L_04.pdf; ComponentLink2Description: Digi-Key Listing; ComponentLink2URL: https://www.digikey.com/product-detail/en/yageo/RC0402JR-073K3L/311-3.3KJRTR-ND/726456; Tolerance: 5%; Price: 0,0017; Device Package: 0402 (1005 Metric)
R56 R57 = ERJ-2RKF3300X: RES SMD 330 OHM 1% 1/10W 0402; Manufacturer: Panasonic Electronic Components; TemperatureRange: -55C ~ 155C; TemperatureCoefficient: 100ppm/C; PowerRating: 0.1W, 1/10W; Value: 330; Part Number: ERJ-2RKF3300X; PartId: 165; Supplier 1: Digi-Key; Supplier Part Number 1: P330LTR-ND; ComponentLink1Description: Datasheet; ComponentLink1URL: http://industrial.panasonic.com/www-cgi/jvcr13pz.cgi?E+PZ+3+AOA0002+ERJ2RKF3300X+7+WW; ComponentLink2Description: Digikey listing; ComponentLink2URL: http://digikey.com/product-detail/en/ERJ-2RKF3300X/P330LTR-ND/1746189; Price: 0,0043; Type: Thick Film; Device Package: 0402 (1005 Metric)
R61 = ERJ-2RKF5233X: RES SMD 523K OHM 1% 1/10W 0402; Manufacturer: Panasonic Electronic Components; TemperatureRange: -55C ~ 155C; TemperatureCoefficient: 100ppm/C; PowerRating: 0.1W, 1/10W; Value: 523k; Part Number: ERJ-2RKF5233X; PartId: 461; Supplier 1: Digi-Key; Supplier Part Number 1: P523KLTR-ND; ComponentLink1Description: Datasheet; ComponentLink1URL: http://industrial.panasonic.com/www-cgi/jvcr13pz.cgi?E+PZ+3+AOA0002+ERJ2RKF5233X+7+WW; ComponentLink2Description: Digikey listing; ComponentLink2URL: http://digikey.com/product-detail/en/ERJ-2RKF5233X/P523KLTR-ND/192400; Tolerance: 1%; Price: 0,0043; Type: Thick Film; Device Package: 0402 (1005 Metric)
R62 = ERJ-2GEJ202X: as R50 on sheet [04] Power & Battery; Value: 2k; Part Number: ERJ-2GEJ202X; PartId: 11049; Supplier 1: Digi-Key; Supplier Part Number 1: P2.0KJTR-ND; ComponentLink1Description: Datasheet; ComponentLink1URL: http://industrial.panasonic.com/www-cgi/jvcr13pz.cgi?E+PZ+3+AOA0001+ERJ2GEJ202X+7+WW; ComponentLink2Description: Digi-Key Listing; ComponentLink2URL: https://www.digikey.com/product-detail/en/panasonic-electronic-components/ERJ-2GEJ202X/P2.0KJTR-ND/146958; Tolerance: 5%; Price: 0,0019; Device Package: 0402 (1005 Metric)
R63 = ERJ-2RKF1003X: RES SMD 100K OHM 1% 1/10W 0402; Manufacturer: Panasonic Electronic Components; TemperatureRange: -55C ~ 155C; TemperatureCoefficient: 100ppm/C; PowerRating: 0.1W, 1/10W; Value: 100k; Part Number: ERJ-2RKF1003X; PartId: 2; Supplier 1: Digi-Key; Supplier Part Number 1: P100KLTR-ND; ComponentLink1Description: Datasheet; ComponentLink1URL: http://industrial.panasonic.com/www-cgi/jvcr13pz.cgi?E+PZ+3+AOA0002+ERJ2RKF1003X+7+WW; ComponentLink2Description: Digikey listing; ComponentLink2URL: http://digikey.com/product-detail/en/ERJ-2RKF1003X/P100KLTR-ND/192081; Tolerance: 1%; Price: 0,0043; Type: Thick Film; Device Package: 0402 (1005 Metric)
Y2 = NX3225SA-27.12M-STD-CSR-3: CRYSTAL 27.1200MHZ 8PF SMD; Manufacturer: NDK; Frequency Stability: 10ppm; Load Capacitance: 10pF; ESR: 30 Ohm; Operating Mode: Fundamental; PartId: 8523; Supplier 1: Digi-Key; Supplier Part Number 1: 644-1237-2-ND; ComponentLink1Description: Datasheet; ComponentLink1URL: http://www.ndk.com/images/products/catalog/c_NX3225SA-STD-CSR-3_e.pdf; ComponentLink2Description: Digi-Key Listing; ComponentLink2URL: http://www.digikey.com/product-detail/en/NX3225SA-27.12M-STD-CSR-3/644-1237-2-ND/4914451; Price: 0,3842; Type: MHz Crystal; Device Package: 4-SMD, No Lead (DFN, LCC); Frequency: 27.12MHz; Frequency Tolerance: 10ppm

## Sheet [06] Gyroscope.SchDoc: Gyroscope
size A3; Author: Caner ALP; Organization: ALP Electronics; Address1: Axel Oxenstiernas; Address2: Västerås; Address3: 72478; Address4: Sweden; DocumentNumber: 7; SheetNumber: 7; SheetTotal: 7
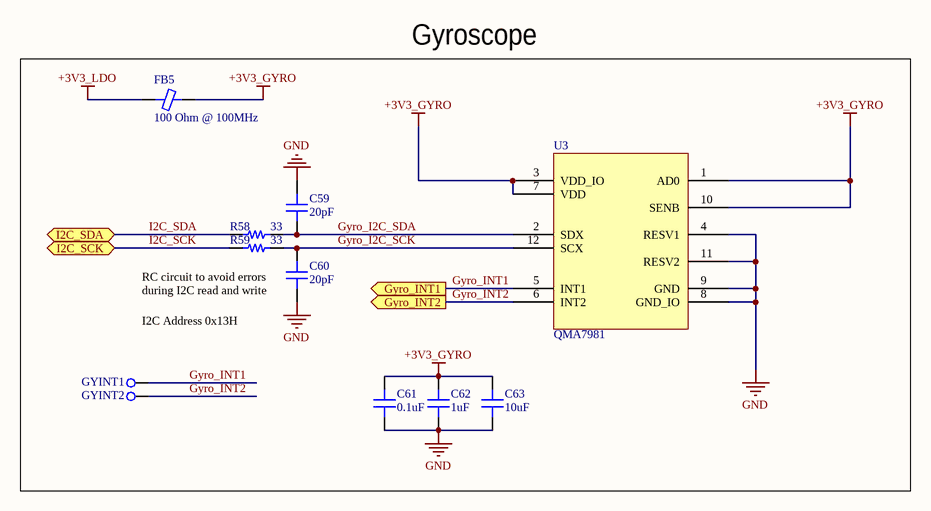
[diagram p6: [06] Gyroscope.SchDoc]

### Parts
C59  20pF  [CAP 0402/1005]
C60  20pF  [CAP 0402/1005]
C61  0.1uF  [CAP 0402/1005]
C62  1uF  [CAP 0603/1608]
C63  10uF  [CAP 0603/1608]
FB5  100 Ohm @ 100MHz  [FER 0603/1608]
GYINT1  RCT-0C  [0.5mm-TestPad]  (value not drawn)
GYINT2  RCT-0C  [0.5mm-TestPad]  (value not drawn)
R58  33  [RES 0402/1005]
R59  33  [RES 0402/1005]
U3  QMA7981  [LGA-12 2x2]

### Ports
Gyro_INT1 (out), Gyro_INT2 (out), I2C_SCK (bidir), I2C_SDA (bidir)

### Nets
+3V3_GYRO: C61.2 C62.2 C63.2 FB5.2 U3.1(AD0) U3.3(VDD_IO) U3.7(VDD) U3.10(SENB)
+3V3_LDO: FB5.1
GND: C59.2 C60.1 C61.1 C62.1 C63.1 U3.4(RESV1) U3.8(GND_IO) U3.9(GND) U3.11(RESV2)
Gyro_I2C_SCK: C60.2 R59.2 U3.12(SCX)
Gyro_I2C_SDA: C59.1 R58.2 U3.2(SDX)
Gyro_INT1: GYINT1.1(TP) U3.5(INT1) ; port Gyro_INT1
Gyro_INT2: GYINT2.1(TP) U3.6(INT2) ; port Gyro_INT2
I2C_SCK: R59.1 ; port I2C_SCK
I2C_SDA: R58.1 ; port I2C_SDA

### Notes on the sheet
- Gyroscope
- RC circuit to avoid errors
  during I2C read and write
- I2C Address 0x13H
- Title
- Size:
- Project
- A3
- Revision:
- Date:
- Sheet
- of

### Library data of the parts
C59 C60 = GRM1555C1E200JA01D: CAP CER 20PF 25V NP0 0402; Manufacturer: Murata Electronics North America; TemperatureRange: -55C ~ 125C; TemperatureCoefficient: C0G, NP0; Tolerance: 5%; Value: 20pF; Part Number: GRM1555C1E200JA01D; PartId: 5066; Supplier 1: Digi-Key; Supplier Part Number 1: 490-11364-2-ND; ComponentLink1Description: Datasheet; ComponentLink1URL: http://www.murata.com/~/media/webrenewal/support/library/catalog/products/capacitor/mlcc/c02e.ashx; ComponentLink2Description: Digi-Key listing; ComponentLink2URL: http://digikey.com/product-detail/en/GRM1555C1E200JA01D/490-11364-2-ND/3693725; Voltage: 25V; Price: 0,0118; Type: -; Device Package: 0402 (1005 Metric)
C61 = C1005X7R1A104K050BB: as C38 on sheet [04] Power & Battery; Value: 0.1uF; Part Number: C1005X7R1A104K050BB; PartId: 3900; Supplier 1: Digi-Key; Supplier Part Number 1: 445-4958-2-ND; ComponentLink1Description: Datasheet; ComponentLink1URL: https://product.tdk.com/info/en/catalog/datasheets/mlcc_commercial_general_en.pdf; ComponentLink2Description: Digi-Key listing; ComponentLink2URL: http://digikey.com/product-detail/en/C1005X7R1A104K050BB/445-4958-2-ND/2093226; TemperatureCoefficient: X7R; Voltage: 10V; Price: 0,0066; Type: -; Device Package: 0402 (1005 Metric)
C62 = CGB3B1X7R1A105K055AC: as C32 on sheet [04] Power & Battery; Value: 1uF; Part Number: CGB3B1X7R1A105K055AC; PartId: 4131; Supplier 1: Digi-Key; Supplier Part Number 1: 445-13228-1-ND; ComponentLink1Description: Datasheet; ComponentLink1URL: https://product.tdk.com/info/en/catalog/datasheets/mlcc_commercial_lowprofile_en.pdf; ComponentLink2Description: Digi-Key listing; ComponentLink2URL: http://digikey.com/product-detail/en/CGB3B1X7R1A105K055AC/445-13228-1-ND/3954894; TemperatureCoefficient: X7R; Voltage: 10V; Price: 0,27; Device Package: 0603 (1608 Metric)
C63 = C1608X5R1A106M080AC: as C35 on sheet [04] Power & Battery; Value: 10uF; Part Number: C1608X5R1A106M080AC; PartId: 13099; Supplier 1: Digi-Key; Supplier Part Number 1: 445-6853-2-ND; ComponentLink1Description: Datasheet; ComponentLink1URL: https://product.tdk.com/info/en/catalog/datasheets/mlcc_commercial_general_en.pdf; ComponentLink2Description: Digi-Key Listing; ComponentLink2URL: https://www.digikey.com/product-detail/en/tdk-corporation/C1608X5R1A106M080AC/445-6853-2-ND/2619194; TemperatureCoefficient: X5R; Voltage: 10V; Price: 0,0935; Device Package: 0603 (1608 Metric)
FB5 = BKP1608HS101-T: as FB4 on sheet [05] NFC; Part Number: BKP1608HS101-T; PartId: 6594; Value: 100 Ohm @ 100MHz; Supplier 1: Digi-Key; Supplier Part Number 1: 587-1922-2-ND; ComponentLink1Description: Datasheet; ComponentLink1URL: http://ds.yuden.co.jp/TYCOMPAS/ut/detail.do?productNo=BKP1608HS101-T&fileName=BKP1608HS101-T_SS&mode=specSheetDownload; ComponentLink2Description: Digi-Key listing; ComponentLink2URL: http://digikey.com/product-detail/en/BKP1608HS101-T/587-1922-2-ND/957775; Price: 0,0247; Device Package: 0603 (1608 Metric)
GYINT1 GYINT2 = RCT-0C: as 3V3 on sheet [04] Power & Battery; Part Number: RCT-0C; PartId: 15704; Supplier 1: Digi-Key; Supplier Part Number 1: A106144CT-ND; ComponentLink1Description: Datasheet; ComponentLink1URL: http://www.te.com/commerce/DocumentDelivery/DDEController?Action=srchrtrv&DocNm=1773266&DocType=DS&DocLang=English; ComponentLink2Description: Digi-Key Listing; ComponentLink2URL: http://www.digikey.com/product-detail/en/te-connectivity-amp-connectors/RCT-0C/A106144CT-ND/3477801; Price: 0,14; Type: PC Test Point; Mounting Type: Surface Mount
R58 R59 = ERJ-2GEJ330X: RES SMD 33 OHM 5% 1/10W 0402; Manufacturer: Panasonic Electronic Components; TemperatureRange: -55C ~ 155C; TemperatureCoefficient: 200ppm/C; PowerRating: 0.1W, 1/10W; Value: 33; Part Number: ERJ-2GEJ330X; PartId: 10984; Supplier 1: Digi-Key; Supplier Part Number 1: P33JTR-ND; ComponentLink1Description: Datasheet; ComponentLink1URL: http://industrial.panasonic.com/www-cgi/jvcr13pz.cgi?E+PZ+3+AOA0001+ERJ2GEJ330X+7+WW; ComponentLink2Description: Digi-Key Listing; ComponentLink2URL: https://www.digikey.com/product-detail/en/panasonic-electronic-components/ERJ-2GEJ330X/P33JTR-ND/146980; Tolerance: 5%; Price: 0,0019; Device Package: 0402 (1005 Metric)
U3 = QMA7981: 3 AXIS ACCEL 12LGA; Manufacturer: QST; Sensor Type: Accelerometer, 3 Axis; Output Type: IC, SPI; Part Number: QMA7981; PartId: 16471; Supplier 1: LCSC; Supplier Part Number 1: C457290; ComponentLink1Description: Datasheet; ComponentLink1URL: https://datasheet.lcsc.com/szlcsc/2004281102_QST-QMA7981_C457290.pdf; ComponentLink2Description: LCSC Listing; ComponentLink2URL: https://lcsc.com/product-detail/Motion-Sensors-Accelerometers_QST-QMA7981_C457290.html; Type: Multifunction; Series: MotionTracking; Operating Temperature: -40C ~ 85C (TA)

## Sheet [07] Information.SchDoc: Information
size A3; Author: Caner ALP; Organization: ALP Electronics; Address1: Axel Oxenstiernas; Address2: Västerås; Address3: 72478; Address4: Sweden

### Notes on the sheet
- Title
- Size:
- Project
- A3
- Revision:
- Date:
- Sheet
- of

## Nets that join several sheets
+3V3: [02] ESP32-S2 Module (FB1.1), [04] Power & Battery (5 pins), [05] NFC (FB4.1)
+3V3_LDO: [03] Codec (FB2.1), [04] Power & Battery (3V3_LDO.1 C46.2 C48.2 IC4.5), [06] Gyroscope (FB5.1)
+3V3_MOD: [02] ESP32-S2 Module (16 pins), [04] Power & Battery (R48.2)
GND: [02] ESP32-S2 Module (21 pins), [03] Codec (R30.1), [04] Power & Battery (38 pins), [05] NFC (20 pins), [06] Gyroscope (9 pins)
VBAT: [02] ESP32-S2 Module (R1.2), [03] Codec (FB3.1), [04] Power & Battery (8 pins)
CHARGE: [02] ESP32-S2 Module (R7.1), [04] Power & Battery (CHG.1 IC6.8 R48.1)
Codec_GPIO1: [02] ESP32-S2 Module (E1.32), [03] Codec (C_GPIO1.1 U1.26)
Codec_GPIO2: [02] ESP32-S2 Module (E1.31), [03] Codec (C_GPIO2.1 U1.4)
Codec_I2S0_ASDOUT: [02] ESP32-S2 Module (R11.1), [03] Codec (DOUT1.1 U1.8)
Codec_I2S0_DSDIN: [02] ESP32-S2 Module (R13.1), [03] Codec (DIN1.1 U1.10)
Codec_I2S0_LRCK: [02] ESP32-S2 Module (R12.1), [03] Codec (LRCLK1.1 U1.9)
Codec_I2S0_MCLK: [02] ESP32-S2 Module (R9.1), [03] Codec (MCLK1.1 U1.2)
Codec_I2S0_SCLK: [02] ESP32-S2 Module (R10.1), [03] Codec (SCLK1.1 U1.7)
Gyro_INT1: [02] ESP32-S2 Module (R8.1), [06] Gyroscope (GYINT1.1 U3.5)
Gyro_INT2: [02] ESP32-S2 Module (R6.1), [06] Gyroscope (GYINT2.1 U3.6)
HP_DETECT: [02] ESP32-S2 Module (E1.30), [03] Codec (J2.2 R38.1)
I2C_SCK: [02] ESP32-S2 Module (E1.7 R4.1 SCK.1), [03] Codec (R34.1), [06] Gyroscope (R59.1)
I2C_SDA: [02] ESP32-S2 Module (E1.6 R5.1 SDA.1), [03] Codec (R33.1), [06] Gyroscope (R58.1)
LDO_EN: [02] ESP32-S2 Module (E1.39), [04] Power & Battery (IC4.3 LDO_EN.1)
NFC_IRQIN: [02] ESP32-S2 Module (R26.2), [05] NFC (R53.2 U2.12)
NFC_IRQOUT: [02] ESP32-S2 Module (R27.2), [05] NFC (R54.2 U2.14)
SPI2_CLK: [02] ESP32-S2 Module (CLK.1 J1.5 R16.1), [05] NFC (U2.18)
SPI2_CS_NFC: [02] ESP32-S2 Module (R25.2), [05] NFC (U2.15)
SPI2_MISO: [02] ESP32-S2 Module (J1.7 MISO.1 R15.1), [05] NFC (U2.16)
SPI2_MOSI: [02] ESP32-S2 Module (J1.3 MOSI.1 R17.1), [05] NFC (U2.17)
USBD_N: [02] ESP32-S2 Module (C9.2 R23.2), [04] Power & Battery (D2.1 J4.A7 J4.B7)
USBD_P: [02] ESP32-S2 Module (C8.1 R22.2), [04] Power & Battery (D2.2 J4.A6 J4.B6)